# Altium schematic sheet SSD1306.SchDoc
size A4
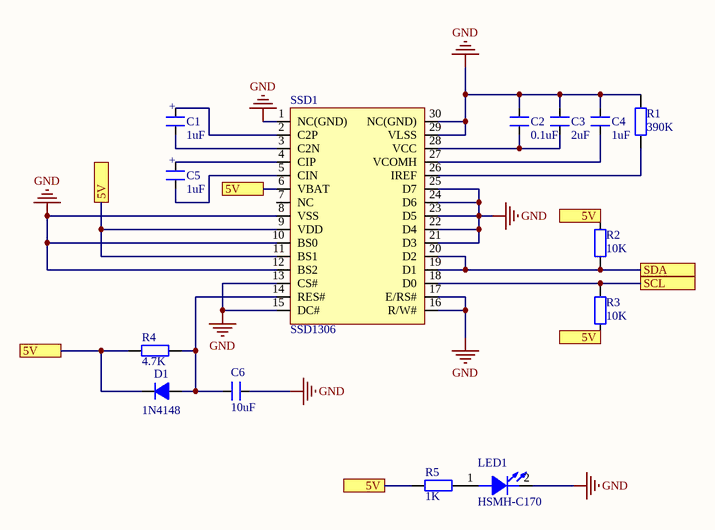
[diagram p0: SSD1306.SchDoc]

## Parts
C1  1uF  [SM-0805]
C2  0.1uF  [SM-0805]
C3  2uF  [SM-0805]
C4  1uF  [SM-0805]
C5  1uF  [SM-0805]
C6  10uF  [SM-0805]
D1  Diode  [DO-214AC,SMA]  (value not drawn)
LED1  HSMH-C170  [LED.SMD.GREEN]
R1  value 390K  [DIEN TRO 0805]  (hidden comment: RES_SMD_0805)
R2  value 10K  [DIEN TRO 0805]  (hidden comment: RES_SMD_0805)
R3  value 10K  [DIEN TRO 0805]  (hidden comment: RES_SMD_0805)
R4  value 4.7K  [DIEN TRO 0805]  (hidden comment: RES_SMD_0805)
R5  value 1K  [DIEN TRO 0805]  (hidden comment: RES_SMD_0805)
SSD1  SSD1306  [SSD1306]

## Ports
5V, SCL, SDA

## Nets
GND: C2.2 C3.2 C4.2 C6.2 LED1.2(K) R1.2 SSD1.1(NC(GND)) SSD1.8(VSS) SSD1.10(BS0) SSD1.12(BS2) SSD1.13(CS#) SSD1.15(DC#) SSD1.16(R/W#) SSD1.17(E/RS#) SSD1.21(D3) SSD1.22(D4) SSD1.23(D5) SSD1.24(D6) SSD1.25(D7) SSD1.29(VLSS) SSD1.30(NC(GND))
5V: D1.2(K) R2.2 R3.1 R4.1 R5.1 SSD1.6(VBAT) SSD1.9(VDD) SSD1.11(BS1) ; port 5V
SCL: R3.2 SSD1.18(D0) ; port SCL
SDA: R2.1 SSD1.19(D1) SSD1.20(D2) ; port SDA
NetC1_1: C1.1 SSD1.3(C2N)
NetC1_2: C1.2 SSD1.2(C2P)
NetC2_1: C2.1 C3.1 SSD1.28(VCC)
NetC4_1: C4.1 SSD1.27(VCOMH)
NetC5_1: C5.1 SSD1.5(CIN)
NetC5_2: C5.2 SSD1.4(CIP)
NetC6_1: C6.1 D1.1(A) R4.2 SSD1.14(RES#)
NetLED1_1: LED1.1(A) R5.2
NetR1_1: R1.1 SSD1.26(IREF)

Not connected (* = marked no-connect by the designer): SSD1 7(NC)

## Notes on the sheet
- (near C1) +
- (near C5) +
- (near D1) 1N4148

## Library data of the parts
C1-C6 = CM: Cap SMD; Value: 103
D1 = Diode: Vendor: Digikey; Value: FRxxx; Published: 8-Jun-2000; LatestRevisionDate: 17-Jul-2002; LatestRevisionNote: Re-released for DXP Platform.; DatasheetDocument: 1997; PackageReference: DO-35; Publisher: Altium Limited; Code_JEDEC: DO-204-AH; ComponentLink1Description: Digikey Part Link; ComponentLink1URL: http://www.fairchildsemi.com/; ComponentLink2Description: Open Datasheet; ComponentLink2URL: H:\LIBRARY\LIBRARY.Datasheet\ds26003.pdf
LED1 = LED_1: Typical GaAs SMD LED; Manufacturer: Lite-On Inc; Color: RED; Type: Cong ty RP; Vendor: Digikey; Publisher: Hoang Nguyen; Price: *; Published: 13-April-2009; ComponentLink1Description: Digikey Part Link; ComponentLink2Description: Open Datasheet; ComponentLink2URL: H:\LIBRARY\LIBRARY.Datasheet\
R1-R5 = RES_SMD_0805: RES_0805; Published: 8-Jun-2000; LatestRevisionDate: 17-Jul-2002; LatestRevisionNote: Re-released for DXP Platform.; PackageReference: AXIAL-0.4; Publisher: Altium Limited